# EasyEDA Pro project SimGEKI2_FrontIO.epro

# Schematic FrontPannel_2
Board Name: FrontPannel_ExtraPower; Create Date: 2025-03-07; Page Name: P1; Project Name: ongeki-controller; Schematic Name: FrontPannel_2; Update Date: 2025-04-17; Company: 嘉立创EDA; Page Size: A4; Version: V1.0
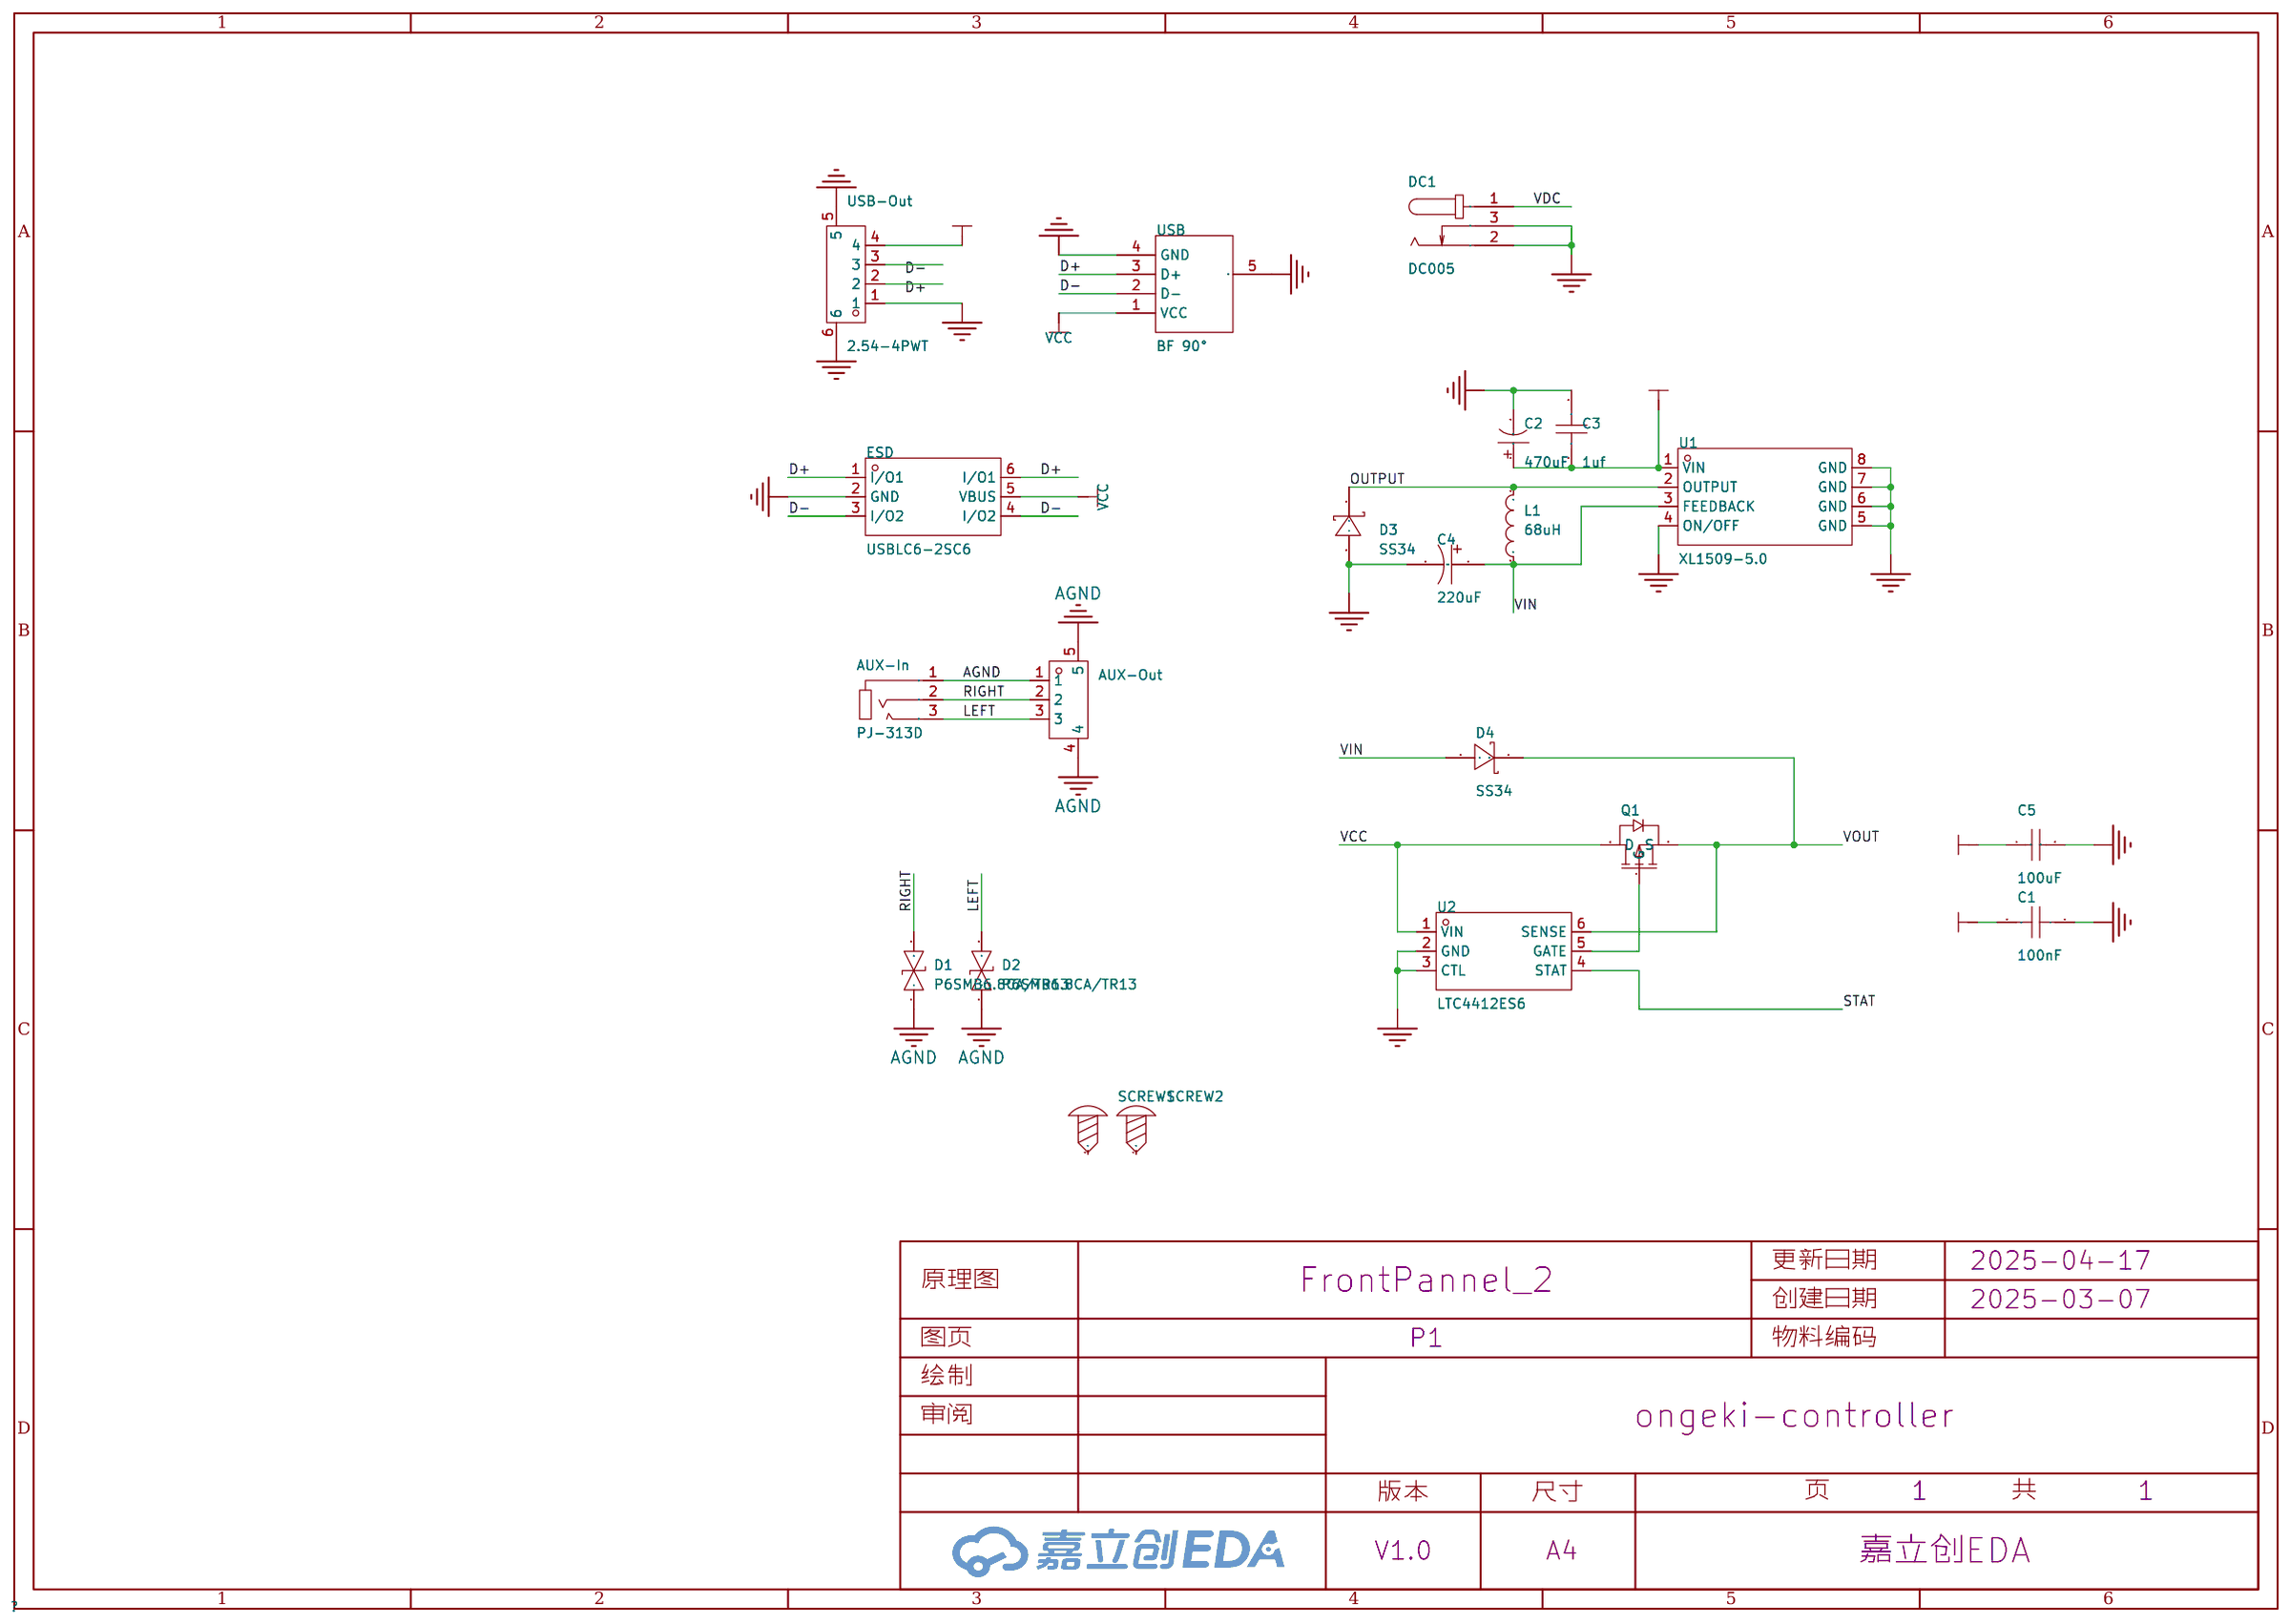
[diagram p0: schematic sheet]

## Parts
AUX-In  PJ-313D  [AUDIO-SMD_PJ-313D-2]
AUX-Out  WAFER-PH2.0-3PWB  [CONN-SMD_3P-P2.00_XUNPU_WAFER-PH2.0-3PWB]
C1  100nF  [C0603]
C2  470uF  [CAP-SMD_BD10.0-L10.3-W10.3-LS11.0-R-RD]
C3  1uf  [C0603]
C4  220uF  [CAP-SMD_BD6.3-L6.6-W6.6-FD]
C5  100uF  [C1206]
D1  P6SMB6.8CA/TR13  [SMB_L4.6-W3.6-LS5.3-BI]
D2  P6SMB6.8CA/TR13  [SMB_L4.6-W3.6-LS5.3-BI]
D3  SS34  [SMA_L4.3-W2.6-LS5.2-RD]
D4  SS34  [SMA_L4.3-W2.6-LS5.2-RD]
DC1  DC005  [DC-IN-TH_DC005]
ESD  USBLC6-2SC6  [SOT-23-6_L2.9-W1.6-P0.95-LS2.8-BL]
L1  68uH  [IND-SMD_L7.1-W6.6]
Q1  -  [AO3401A_SOT-23-3]
SCREW1  -  [M4螺丝]
SCREW2  -  [M4螺丝]
U1  XL1509-5.0  [SOIC-8_L4.9-W3.9-P1.27-LS6.0-TR]
U2  LTC4412ES6  [TSOT-23-6_L2.9-W1.6-P0.95-LS2.8-BR]
USB  BF 90°  [USB-B_TH_BF90]
USB-Out  2.54-4PWT  [COMM-SMD_4P-P2.50_SHOUHAN_2.54-4PWT]

## Library data of the parts
AUX-In = PJ-313D_C668608: 连接器类型:3.5mm耳机座;额定电流:500mA;额定电压:30V;工作温度范围:-30℃~+70℃;; LCSC Part Name: 3.5mm耳机座; Supplier Part: C668608; Manufacturer: SHOU HAN(首韩); Supplier Footprint: SMD; JLCPCB Part Class: 扩展库; Datasheet: https://atta.szlcsc.com/upload/public/pdf/source/20200618/C668608_AB2020DBBA26E8897834D328F2FA3C40.pdf; Supplier: LCSC; Connector Type: 3.5mm耳机座; Current Rating (Max): 500mA; Voltage Rating (Max): 30V; Operating Temperature Range: -30℃~+70℃
AUX-Out = WAFER-PH2.0-3PWB: 插针结构:1x3P;间距:2mm;安装方式:卧贴;总PIN数:3P;排数:1;每排PIN数:3;额定电流:2A;工作温度范围:-25℃~+85℃;; LCSC Part Name: 1x3P 间距:2mm 卧贴; Supplier Part: C3029441; Manufacturer: XUNPU(讯普); Supplier Footprint: SMD,P=2mm,卧贴; JLCPCB Part Class: 扩展库; Datasheet: https://atta.szlcsc.com/upload/public/pdf/source/20220527/83903C18429EFE4C9EEE8C529A248431.pdf; Supplier: LCSC; Pins Structure: 1x3P; Pitch: 2mm; Mounting Style: 卧贴; Number of Pins: 3P; Number of Rows: 1; Number of PINs Per Row: 3; Current Rating (Max): 2A; Operating Temperature Range: -25℃~+85℃
C1 C3 = CAP_0603: Supplier Footprint: 0603
C2 = RVT1V471M1010_C72519: 容值:470uF;精度:±20%;额定电压:35V;纹波电流:286mA@120Hz;等效串联电阻(ESR):-;; LCSC Part Name: 470uF ±20% 35V; Supplier Part: C72519; Manufacturer: ROQANG(容强); Manufacturer Part: RVT1V471M1010; Supplier Footprint: SMD,D10xL10.2mm; JLCPCB Part Class: Extended Part; Datasheet: https://atta.szlcsc.com/upload/public/pdf/source/20210128/C72519_A1B8ED607B11AD36B70B1D23AFC8819E.pdf; Supplier: LCSC; Tolerance: ±20%; Voltage Rating: 35V; Ripple Current: 286mA@120Hz; Diameter: 10mm; Height - Seated (Max): 10.2mm; Lifetime: 2000hrs@105℃; Operating Temperature: -40℃~+105℃
C4 = RVT1C221M0607_C72496: 容值:220uF;精度:±20%;额定电压:16V;纹波电流:110mA@120Hz;等效串联电阻(ESR):-;; LCSC Part Name: 220uF ±20% 16V; Supplier Part: C72496; Manufacturer: ROQANG(容强); Manufacturer Part: RVT1C221M0607; Supplier Footprint: SMD,D6.3xL7.7mm; JLCPCB Part Class: Extended Part; Datasheet: https://atta.szlcsc.com/upload/public/pdf/source/20170325/1490427950282.pdf; Supplier: LCSC; Tolerance: ±20%; Voltage Rating: 16V; Ripple Current: 110mA@120Hz; Diameter: 6.3mm; Height - Seated (Max): 7.7mm; Lifetime: 2000hrs@105℃; Operating Temperature: -40℃~+105℃
C5 = CL31A107MQHNNNE: 容值:100uF;精度:±20%;额定电压:6.3V;材质(温度系数):X5R;; LCSC Part Name: 100uF ±20% 6.3V; Supplier Part: C15008; Manufacturer: SAMSUNG(三星); Supplier Footprint: 1206; JLCPCB Part Class: Basic Part; Datasheet: https://atta.szlcsc.com/upload/public/pdf/source/20160218/1457707763339.pdf; Supplier: LCSC; Tolerance: ±20%; Voltage Rated: 6.3V; Temperature Coefficient: X5R
D1 D2 = P6SMB6.8CA/TR13: 反向截止电压(Vrwm):5.8V;钳位电压:10.5V;峰值脉冲电流(Ipp):58.1A;峰值脉冲功率(Ppp):600W;击穿电压:6.45V;; Supplier Part: C78395; Manufacturer: Brightking(君耀电子); Supplier Footprint: SMB(DO-214AA); JLCPCB Part Class: 基础库; Datasheet: https://atta.szlcsc.com/upload/public/pdf/source/20160709/1468031879762.pdf; Supplier: LCSC; Reverse Stand-Off Voltage (Vrwm): 5.8V; Clamping Voltage: 10.5V; Peak Pulse Current (Ipp): 58.1A; Peak Pulse Power Dissipation (Ppp): 600W; Voltage - Breakdown: 6.45V; Type: TVS
D3 D4 = SS34_C8678: 二极管配置:独立式;正向压降(Vf):550mV@3A;直流反向耐压(Vr):40V;整流电流:3A;; LCSC Part Name: 电压:40V 电流:3A; Supplier Part: C8678; Manufacturer: MDD(辰达半导体); Supplier Footprint: SMA(DO-214AC); JLCPCB Part Class: 基础库; Datasheet: https://atta.szlcsc.com/upload/public/pdf/source/20240710/2118BB86FDDB2E0B294389AC1F3F65C8.pdf; Supplier: LCSC; Diode Configuration: 独立式; Forward Voltage (Vf@If): 550mV@3A; Reverse Voltage (Vr): 40V; Rectified Current: 3A; Reverse Leakage Current (Ir): 500uA@40V
DC1 = DC005: 连接器类型:DC电源插座;安装方式:弯插;触点内径:2mm;触点外径:6.3mm;额定电流:500mA;额定电压:30V;工作温度范围:-25℃~+70℃;; LCSC Part Name: DC电源插座 内径:2mm 外径:6.3mm; Supplier Part: C431533; Manufacturer: SHOU HAN(首韩); Supplier Footprint: 插件; JLCPCB Part Class: 扩展库; Datasheet: https://atta.szlcsc.com/upload/public/pdf/source/20190925/C431533_4751811035784AC1D38EBC85F7905E99.pdf; Supplier: LCSC; Connector Type: DC电源插座; Mounting Style: 弯插; Inside Contact Diameter: 2mm; Outside Contact Diameter: 6.3mm; Current Rating (Max): 500mA; Voltage Rating (Max): 30V; Operating Temperature Range: -25℃~+70℃
ESD = USBLC6-2SC6: Supplier Part: C2687116; Manufacturer: UMW(广东友台半导体); Supplier Footprint: SOT-23-6; JLCPCB Part Class: Extended Part; Datasheet: https://atta.szlcsc.com/upload/public/pdf/source/20220623/8F66CD7F92B22A875BD04E197BDA4F88.pdf; Supplier: LCSC
L1 = SMMS0650-680M: 电感值:68uH;精度:±20%;额定电流:1.5A;饱和电流(Isat):2A;类型:一体成型电感;; LCSC Part Name: 68uH ±20% 2A; Supplier Part: C2894721; Manufacturer: SXN(顺翔诺); Supplier Footprint: SMD,6.6x7.1mm; JLCPCB Part Class: 扩展库; Datasheet: https://atta.szlcsc.com/upload/public/pdf/source/20210910/523B6BB0C4A09F37806A127B1ABE761D.pdf; Supplier: LCSC; Tolerance: ±20%; Rated Current: 1.5A; Saturation Current (Isat): 2A; DC Resistance (DCR): 442mΩ; Type: 一体成型电感
Q1 = AO3401A_P: Supplier Footprint: SOT-23-3L; Supplier Part: C15127
SCREW1 SCREW2 = M4螺丝: Supplier Footprint: 插件
U1 = XL1509-5.0: 功能类型:降压型;输出类型:固定;工作电压:4.5V~40V;输出电压:5V;输出电流:2A;; LCSC Part Name: 150 KHz 固定频率 PWM 降压 DC/DC 转换器; Supplier Part: C2902368; Manufacturer: UMW(友台半导体); Supplier Footprint: SOIC-8; JLCPCB Part Class: 扩展库; Datasheet: https://atta.szlcsc.com/upload/public/pdf/source/20241113/D9907419AB21EE12D855D7DFAFDDCB19.pdf; Supplier: LCSC; Function: 降压型; Output Type: 固定; Input Voltage: 4.5V~40V; Output Voltage: 5V; Output Current: 2A; Switching Frequency: 150kHz; Operating Temperature: -40℃~+125℃; Synchronous Rectification: 否; Number of Outputs: 1; Topology: 降压式; Quiescent Current (Iq): 150uA; Switch tube (built-in/external): 内置
U2 = LTC4412ES6#TRPBF: 电源电压:2.5V~28V;; Supplier Part: C514442; Manufacturer: ADI(亚德诺); Supplier Footprint: TSOT-23-6; JLCPCB Part Class: 扩展库; Datasheet: https://atta.szlcsc.com/upload/public/pdf/source/20191127/C459903_E07DB0C4019C6348E4B0C2B47053A4E9.pdf; Supplier: LCSC; Supply Voltage: 2.5V~28V; Operating Temperature: -40℃~+85℃
USB = BF 90°: 连接器类型:Type-B;标准:USB 2.0;公母:母;端口数量:1;触点数量:4P;安装方式:弯插;额定电流 - 电源:1.5A;工作温度范围:-25℃~+85℃;; LCSC Part Name: Type-B 母 弯插; Supplier Part: C456014; Manufacturer: SHOU HAN(首韩); Supplier Footprint: 插件; JLCPCB Part Class: 扩展库; Datasheet: https://atta.szlcsc.com/upload/public/pdf/source/20191113/C456014_C740506ED5D4B26CF619D62A688F072E.pdf; Supplier: LCSC; Connector Type: Type-B; Standard: USB 2.0; Gender: 母; Number of Ports: 1; Number of Contacts: 4P; Mounting Style: 弯插; Current Rating - Power (Max): 1.5A; Operating Temperature Range: -25℃~+85℃
USB-Out = 2.54-4PWT: 插针结构:1x4P;间距:2.5mm;公母:公;安装方式:卧贴;排数:1;每排PIN数:4;额定电流:3A;工作温度范围:-25℃~+85℃;; LCSC Part Name: 1x4P 间距:2.5mm 卧贴 2.54间距 4P卧贴; Supplier Part: C3008582; Manufacturer: SHOU HAN(首韩); Supplier Footprint: SMD,P=2.5mm; JLCPCB Part Class: Extended Part; Datasheet: https://atta.szlcsc.com/upload/public/pdf/source/20220427/2E7F20871E2A02EADA0277D3DA8C9F6A.pdf; Supplier: LCSC; Pins Structure: 1x4P; Pitch: 2.5mm; Gender: 公; Mounting Style: 卧贴; Number of Rows: 1; Number of PINs Per Row: 4; Current Rating (Max): 3A; Operating Temperature Range: -25℃~+85℃

## Nets
AGND: AUX-In.1 AUX-Out.1 AUX-Out.4 AUX-Out.5 D1.1 D2.1
GND: C1.1 C2.2 C3.2 C4.2 C5.2 D3.2(A) DC1.2 DC1.3 ESD.2(GND) U1.4(ON/OFF) U1.5(GND) U1.6(GND) U1.7(GND) U1.8(GND) U2.2(GND) U2.3(CTL) USB.4(GND) USB.5(EH) USB-Out.1 USB-Out.5 USB-Out.6
VCC: ESD.5(VBUS) Q1.3(D) U2.1(VIN) USB.1(VCC)
VIN: C4.1 D4.2(A) L1.2 U1.3(FEEDBACK)
D+: ESD.1(I/O1) ESD.6(I/O1) USB.3(D+) USB-Out.2
D-: ESD.3(I/O2) ESD.4(I/O2) USB.2(D-) USB-Out.3
LEFT: AUX-In.3 AUX-Out.3 D2.2
OUTPUT: D3.1(K) L1.1 U1.2(OUTPUT)
RIGHT: AUX-In.2 AUX-Out.2 D1.2
STAT: U2.4(STAT)
VDC: C2.1 C3.1 DC1.1 U1.1(VIN)
VOUT: C1.2 C5.1 D4.1(K) Q1.2(S) U2.6(SENSE) USB-Out.4
$1N4109: Q1.1(G) U2.5(GATE)

Not connected (* = marked no-connect by the designer): SCREW1 1; SCREW2 1

# Board FrontPannel_2
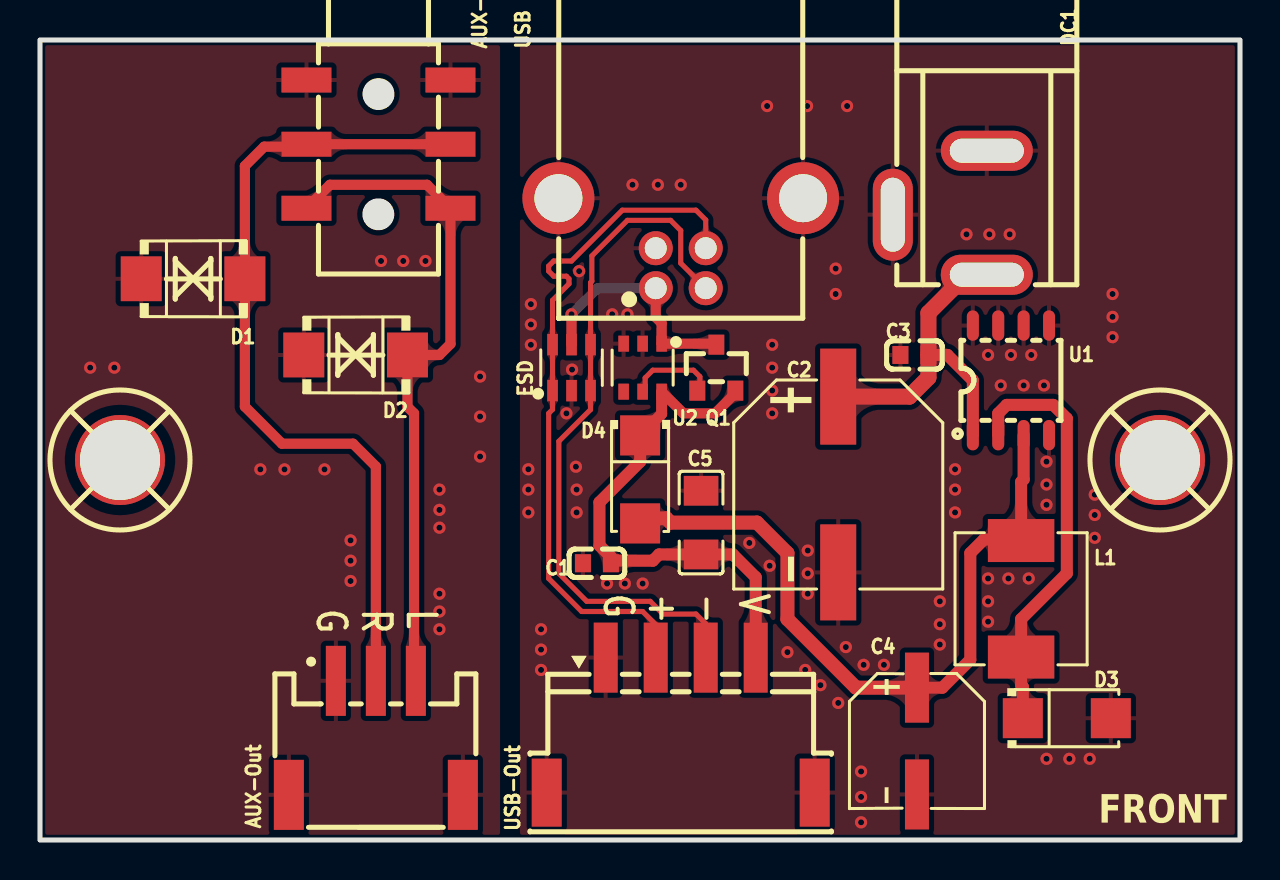
[diagram p1: board, top side]
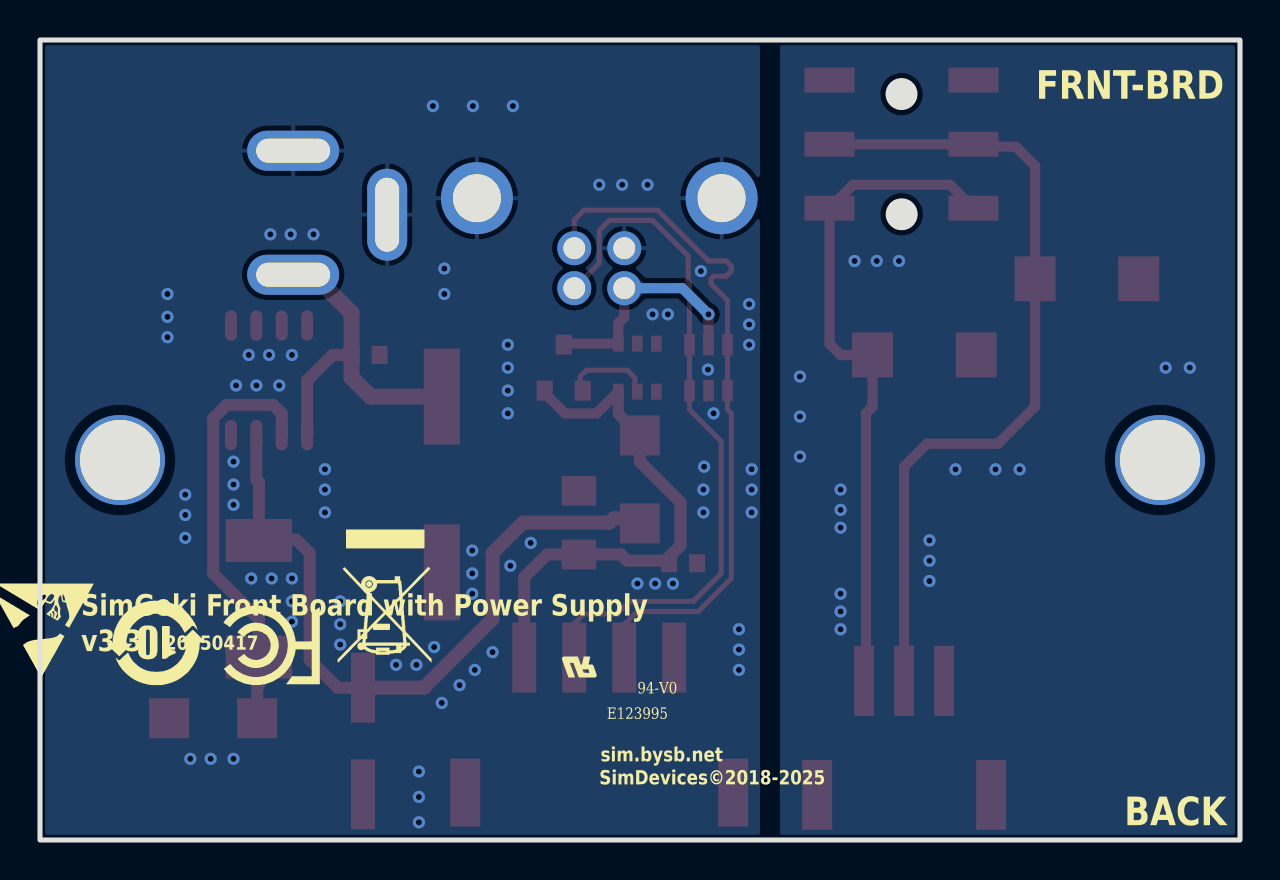
[diagram p2: board, bottom side, seen from below]

Outline 60 x 40 mm; copper layers: Top Layer, Bottom Layer. Coordinates in mm from the lower left corner of the outline.
Outline path: rectangle 0,40 60,0
Stack: Top Layer 0.035mm / Dielectric1 1.51mm FR4 er 4.5 / Bottom Layer 0.035mm

## Design rules (mm)
net D-: DP1
net D+: DP1
template: JLCPCB Capability(Two Layers Board)
spacing copperThickness1oz (default): track to track 0.102, other pairs 0.152 to 0.3
spacing copperThickness2oz: track to track 0.203, other pairs 0.152 to 0.3
track width copperThickness1oz (default): min 0.127, default 0.254, max 2.54
track width copperThickness2oz: min 0.203, default 0.254, max 2.54
differential pair differentialPair (default): width min 0.127, default 0.254, max 2.54; gap min 0.152, default 0.152
via viaSize (default): diameter min 0.5, default 0.61, max 10; hole min 0.3, default 0.305, max 6.3

## Placement (name value [footprint] x y rotation side)
AUX-In  PJ-313D  [AUDIO-SMD_PJ-313D-2]  16.92 34.79 0 top
AUX-Out  WAFER-PH2.0-3PWB  [CONN-SMD_3P-P2.00_XUNPU_WAFER-PH2.0-3PWB]  16.79 5.11 0 top
C1  100nF  [C0603]  27.85 13.84 0 top
C2  470uF  [CAP-SMD_BD10.0-L10.3-W10.3-LS11.0-R-RD]  39.91 17.78 90 top
C3  1uf  [C0603]  43.72 24.25 180 top
C4  220uF  [CAP-SMD_BD6.3-L6.6-W6.6-FD]  43.85 4.95 270 top
C5  100uF  [C1206]  33.05 15.87 90 top
D1  P6SMB6.8CA/TR13  [SMB_L4.6-W3.6-LS5.3-BI]  7.65 28.06 0 top
D2  P6SMB6.8CA/TR13  [SMB_L4.6-W3.6-LS5.3-BI]  15.78 24.25 0 top
D3  SS34  [SMA_L4.3-W2.6-LS5.2-RD]  51.34 6.09 0 top
D4  SS34  [SMA_L4.3-W2.6-LS5.2-RD]  30 18.03 270 top
DC1  DC005  [DC-IN-TH_DC005]  44.99 31.36 270 top
ESD  USBLC6-2SC6  [SOT-23-6_L2.9-W1.6-P0.95-LS2.8-BL]  26.58 23.62 0 top
L1  68uH  [IND-SMD_L7.1-W6.6]  49.06 12.06 90 top
Q1  -  [AO3401A_SOT-23-3]  33.81 23.62 270 top
SCREW1  -  [M4螺丝]  4 19 0 top
SCREW2  -  [M4螺丝]  56 19 0 top
U1  XL1509-5.0  [SOIC-8_L4.9-W3.9-P1.27-LS6.0-TR]  48.55 22.98 180 top
U2  LTC4412ES6  [TSOT-23-6_L2.9-W1.6-P0.95-LS2.8-BR]  30.13 23.62 90 top
USB  BF 90°  [USB-B_TH_BF90]  32.04 29.84 180 top
USB-Out  2.54-4PWT  [COMM-SMD_4P-P2.50_SHOUHAN_2.54-4PWT]  32.04 5.74 0 top

## Footprints (pads in the part's own frame, mm; a bottom-side part is the same pattern mirrored in y, then rotated)
AO3401A_SOT-23-3
  rect 1x0.8 smd: 1(1.15,-0.95) 2(1.15,0.95) 3(-1.15,0)
AUDIO-SMD_PJ-313D-2
  rect 2.5x1.25 smd: 1(-3.6,3.205) 1(3.6,3.205) 2(-3.6,-0.005) 2(3.6,-0.005) 3(-3.6,-3.205) 3(3.6,-3.205)
C0603
  rect 0.8x0.9 smd: 1(-0.7,0) 2(0.7,0)
C1206
  rect 1.485x1.728 smd: 1(-1.593,0) 2(1.593,0)
CAP-SMD_BD6.3-L6.6-W6.6-FD
  rect 3.5x1.2 smd: 1(-2.67,0) 2(2.67,0)
CAP-SMD_BD10.0-L10.3-W10.3-LS11.0-R-RD
  rect 4.8x1.8 smd: 1(4.395,0) 2(-4.395,0)
COMM-SMD_4P-P2.50_SHOUHAN_2.54-4PWT
  rect 1.2x3.5 smd: 1(-3.75,3.375) 2(-1.25,3.375) 3(1.25,3.375) 4(3.75,3.375)
  rect 1.5x3.4 smd: 5(6.7,-3.375) 6(-6.7,-3.375)
CONN-SMD_3P-P2.00_XUNPU_WAFER-PH2.0-3PWB
  rect 1x3.5 smd: 1(-2,2.85) 2(0,2.85) 3(2,2.85)
  rect 1.5x3.5 smd: 4(4.35,-2.85) 5(-4.35,-2.85)
DC-IN-TH_DC005
  oval 2x4.6 hole 1.2x3.7: 1(3.1,2.35) 2(-3.1,2.35)
  oval 4.6x2 hole 3.7x1.2: 3(0.1,-2.35)
IND-SMD_L7.1-W6.6
  rect 2.15x3.32 smd: 1(-2.913,0) 2(2.913,0)
M4螺丝
  round 4.5 hole 4: 1(0,0)
SMA_L4.3-W2.6-LS5.2-RD
  rect 2x2 smd: 1(-2.2,0) 2(2.2,0)
SMB_L4.6-W3.6-LS5.3-BI
  rect 2.047x2.241 smd: 1(-2.591,0) 2(2.591,0)
SOIC-8_L4.9-W3.9-P1.27-LS6.0-TR
  oval 0.6x1.52 smd: 1(1.905,2.74) 2(0.635,2.74) 3(-0.635,2.74) 4(-1.905,2.74) 5(-1.905,-2.74) 6(-0.635,-2.74) 7(0.635,-2.74) 8(1.905,-2.74)
SOT-23-6_L2.9-W1.6-P0.95-LS2.8-BL
  rect 0.532x1.072 smd: 1(-0.95,-1.149) 2(0,-1.149) 3(0.95,-1.149) 4(0.95,1.149) 5(0,1.149) 6(-0.95,1.149)
TSOT-23-6_L2.9-W1.6-P0.95-LS2.8-BR
  rect 0.8x0.532 smd: 1(1.2,-0.95) 2(1.2,0) 3(1.2,0.95) 4(-1.2,0.95) 5(-1.2,0) 6(-1.2,-0.95)
USB-B_TH_BF90
  round 1.7 hole 1.1: 1(1.25,2.25) 2(-1.25,2.25) 3(-1.25,0.25) 4(1.25,0.25)
  round 3.6 hole 2.4: 5(-6.117,-2.25) 5(6.117,-2.25)

## Nets
As in the schematic.

Pads without a net: SCREW1 1; SCREW2 1

## Via types
v1: diameter 0.61, hole 0.305, Top Layer to Bottom Layer, 100 vias

## Routing (per net, layer and track width the routed paths; a pad name or vN(x,y) marks a point on that pad's centre or on a via; arc(x,y) is an arc through that point)
AGND:
  vias: v1(2.51,23.62) v1(3.72,23.62) v1(11.02,18.53) v1(12.22,18.53) v1(14.22,18.53) v1(15.53,14.98) v1(15.53,13.97) v1(15.53,12.95) v1(17.05,28.95) v1(18.16,28.95) v1(19.27,28.95) v1(19.97,17.52) v1(19.97,16.5) v1(19.97,15.62) v1(19.97,12.31) v1(19.97,11.42) v1(19.97,10.54) v1(22,23.17) v1(22,21.17) v1(22,19.17)
GND:
  vias: v1(24.42,18.54) v1(24.42,17.52) v1(24.42,16.38) v1(24.54,26.79) v1(24.54,25.78) v1(24.54,24.76) v1(25.05,10.54) v1(25.05,9.52) v1(25.05,8.5) v1(26.32,21.33) v1(26.6,23.52) v1(26.8,18.66) v1(26.83,17.52) v1(26.83,16.38) v1(26.96,28.44) v1(28.35,12.82) v1(28.61,26.28) v1(29.24,12.82) v1(29.37,26.28) v1(29.62,32.76) v1(30.13,12.82) v1(30.89,32.76) v1(32.04,32.76) v1(35.47,14.85) v1(36.35,36.7) v1(36.48,13.71) v1(36.61,24.76) v1(36.61,23.62) v1(36.61,22.47) v1(36.61,21.33) v1(37.37,9.39) v1(38.26,8.5) v1(38.35,36.7) v1(38.39,14.47) v1(38.39,13.33) v1(38.39,12.31) v1(39.02,7.74) v1(39.78,28.57) v1(39.78,27.3) v1(39.91,6.85) v1(40.29,9.65) v1(40.35,36.7) v1(41.05,3.42) v1(41.05,2.15) v1(41.05,0.88) v1(41.18,8.76) v1(42.2,8.76) v1(44.99,11.93) v1(44.99,10.79) v1(44.99,9.77) v1(45.75,18.54) v1(45.75,17.52) v1(45.75,16.38) v1(46.32,30.28) v1(47.4,24.25) v1(47.4,13.08) v1(47.4,11.93) v1(47.4,10.92) v1(47.47,30.28) v1(48.04,22.73) v1(48.42,13.08) v1(48.48,30.28) v1(48.55,24.25) v1(49.18,22.73) v1(49.44,13.08) v1(49.56,24.25) v1(50.2,22.73) v1(50.32,18.92) v1(50.32,17.78) v1(50.32,16.76) v1(50.32,4.06) v1(51.47,4.06) v1(52.48,4.06) v1(52.74,17.27) v1(52.74,16.25) v1(52.74,15.11) v1(53.63,27.3) v1(53.63,26.16) v1(53.63,25.14)
VCC: length 12
  Top Layer w0.508: 33.94,24.77 33.89,24.82 U2.1 31.08,25.84 30.79,26.14 USB.1 ; ESD.5 v1(26.58,26.28)
  Bottom Layer w0.508: USB.1 27.88,27.59 v1(26.58,26.28)
VIN: length 36
  Top Layer w0.6: U1.3 49.18,18.03 49.06,17.9 L1.2 49,15.02 47.19,15.02 46.51,14.35 46.51,9.01 45.12,7.62 C4.1
  Top Layer w0.7: 30,16.08 31.32,16.08 31.53,15.87 35.85,15.87 37.37,14.35 37.37,11.04 40.8,7.62 C4.1
D+: length 35.4
  Top Layer w0.254: USB-Out.2 30.79,10.77 30.13,11.42 27.08,11.42 25.43,13.08 25.43,21.33 25.63,21.52 ESD.1 ESD.6 25.63,26.98 26.45,27.81 26.45,28.06 26.32,28.19 25.69,28.19 25.43,28.44 25.43,28.7 25.69,28.95 26.58,28.95 29.12,31.49 32.8,31.49 33.29,31 USB.3
D-: length 35.4
  Top Layer w0.254: USB.2 32.04,28.84 32.04,30.47 31.53,30.98 29.37,30.98 27.59,29.2 27.59,27.94 27.53,27.87 ESD.4 ESD.3 27.53,21.52 25.94,19.93 25.94,13.33 27.34,11.93 30.51,11.93 31.15,11.3 32.8,11.3 33.29,10.81 USB-Out.3
LEFT: length 33.8
  Top Layer w0.508: AUX-Out.3 18.7,8.05 18.7,21.33 18.37,21.66 D2.2 19.97,24.25 20.52,24.8 AUX-In.3 19.35,32.76 14.5,32.76 AUX-In.3
OUTPUT: length 20.9
  Top Layer w0.6: 49.14,6.09 49.14,7.66 49.06,7.74 L1.1 49.06,11.04 51.34,13.33 51.34,21.08 50.66,21.76 48.34,21.76 47.91,21.33 U1.2
RIGHT: length 41.3
  Top Layer w0.508: AUX-Out.2 16.79,18.68 15.65,19.82 12.1,19.82 10.24,21.67 D1.2 10.24,33.7 11.21,34.67 13.2,34.67 AUX-In.2 AUX-In.2
VDC: length 17.3
  Top Layer w0.6: C3.1 45.37,24.25 46.64,22.98 U1.1
  Top Layer w0.8: DC1.1 46.34,28.26 44.42,26.35 C3.1 44.42,23.12 43.47,22.17 C2.1
VOUT: length 26.3
  Top Layer w0.508: U2.6 32.17,21.33 33.76,21.33 34.89,22.47
  Top Layer w0.55: U2.6 31.08,21.31 D4.1
  Top Layer w0.6: C1.2 28.55,14.15 27.97,14.73 27.97,16.89 30,18.92 D4.1 ; 28.93,13.97 30.64,13.97 30.95,14.28 C5.1 34.65,14.28 35.79,13.14 USB-Out.4
$1N4109: length 4.4
  Top Layer w0.254: 32.99,22.47 32.99,23.17 32.67,23.49 30.64,23.49 30.26,23.11 30.26,22.42

## Copper pours and planes (outline as drawn; the poured copper is in the pictures)
AGND on Top Layer: 0,40 23,40 23,0 0,0
AGND on Bottom Layer: 0,40 23,40 23,0 0,0
GND on Top Layer: 24,40 60,40 60,0 24,0
GND on Bottom Layer: 24,40 60,40 60,0 24,0

Small or netless copper shapes (teardrops, artwork), in the pictures only: 54 on Top Layer, 2 on Bottom Layer

## Text on the board
Bottom Silkscreen Layer: sim.bysb.net | SimDevices©2018-2025 | 20250417 | SimGeki Front Board with Power Supply | v3.3 | BACK | FRNT-BRD | 94-V0 | E123995
Top Solder Mask Layer: SimGeki | Front Board | Pwr Sup
Top Silkscreen Layer: L / R / G | V / - / + / G | JLCJLCJLCJLC | FRONT
